# EAGLE design TriangleLEDBoard (EAGLE 9.6.1)
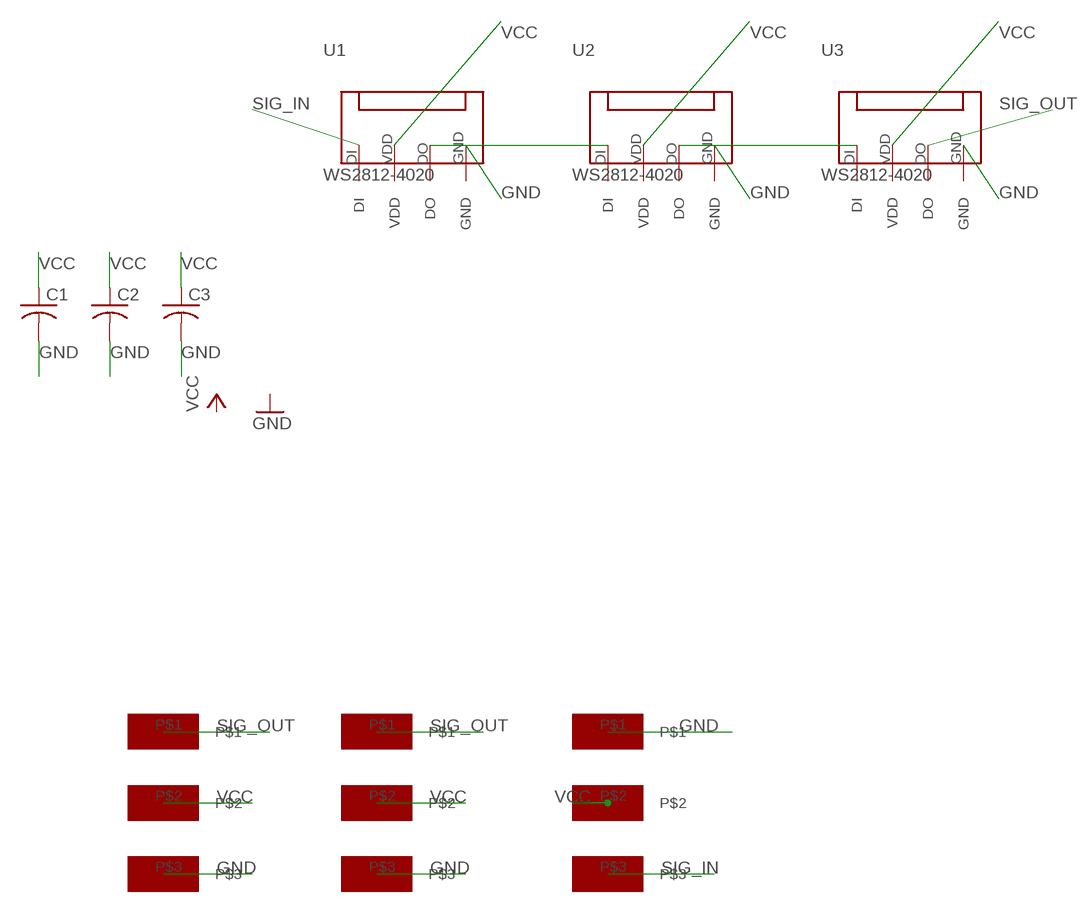
[diagram p0: schematic, sheet 1]

## Parts
C1  C-USC0603  [C0603]
C2  C-USC0603  [C0603]
C3  C-USC0603  [C0603]
U1  WS2812-4020  [WS2812B_4020]
U2  WS2812-4020  [WS2812B_4020]
U3  WS2812-4020  [WS2812B_4020]
U$1  3_CONTACT_PADS_5_MM_SPACING_WITH_HOLES  [RECTANGULAR_PADS_5_MM_SPACING_WITH_HOLES]
U$2  3_CONTACT_PADS_5_MM_SPACING_WITH_HOLES  [RECTANGULAR_PADS_5_MM_SPACING_WITH_HOLES]
U$3  3_CONTACT_PADS_5_MM_SPACING_WITH_HOLES  [RECTANGULAR_PADS_5_MM_SPACING_WITH_HOLES]

## Nets
GND: C1.2 C2.2 C3.2 U1.GND U2.GND U3.GND U$1.P$1 U$2.P$3 U$3.P$3
N$1: U1.DO U2.DI
N$2: U2.DO U3.DI
SIG_IN: U1.DI U$1.P$3
SIG_OUT: U3.DO U$2.P$1 U$3.P$1
VCC: C1.1 C2.1 C3.1 U1.VDD U2.VDD U3.VDD U$1.P$2 U$2.P$2 U$3.P$2

## Library data of the parts
C1-C3 = adafruit:C-US: CAPACITOR, American symbol
U1-U3 = debra:WS2812-4020: WS2812-4020 RGB LED
U$1-U$3 = debra:3_CONTACT_PADS_5_MM_SPACING_WITH_HOLES

## Board
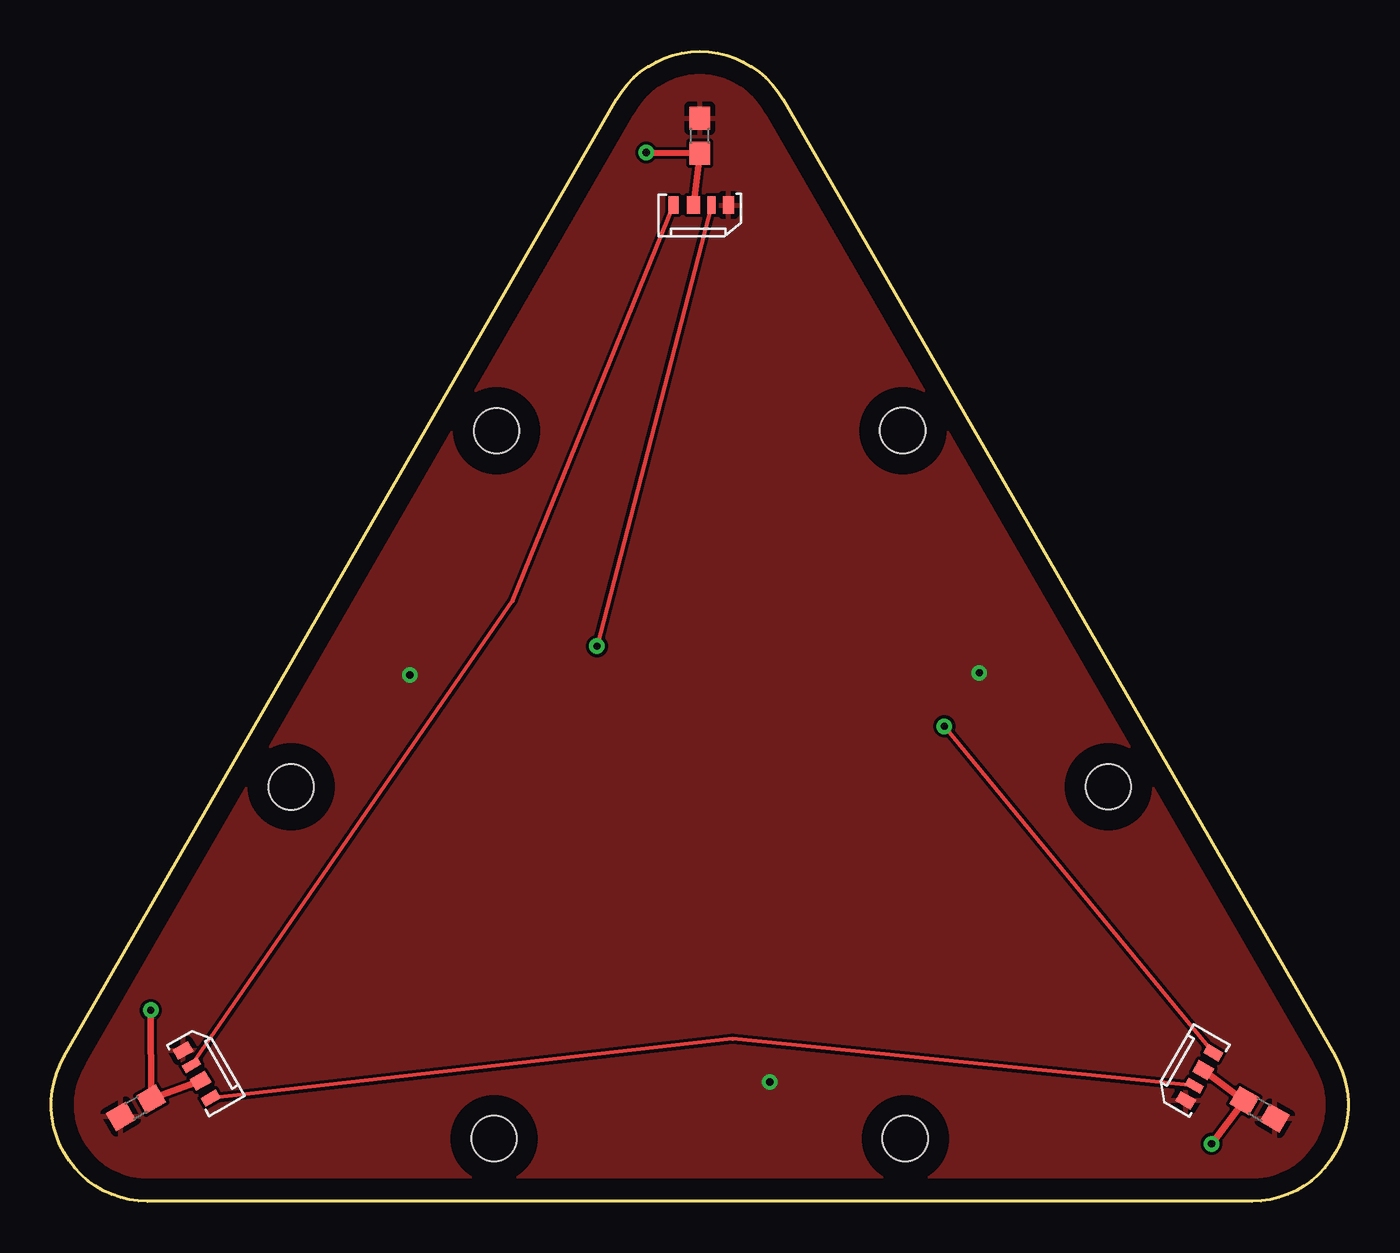
[diagram p1: board, top side]
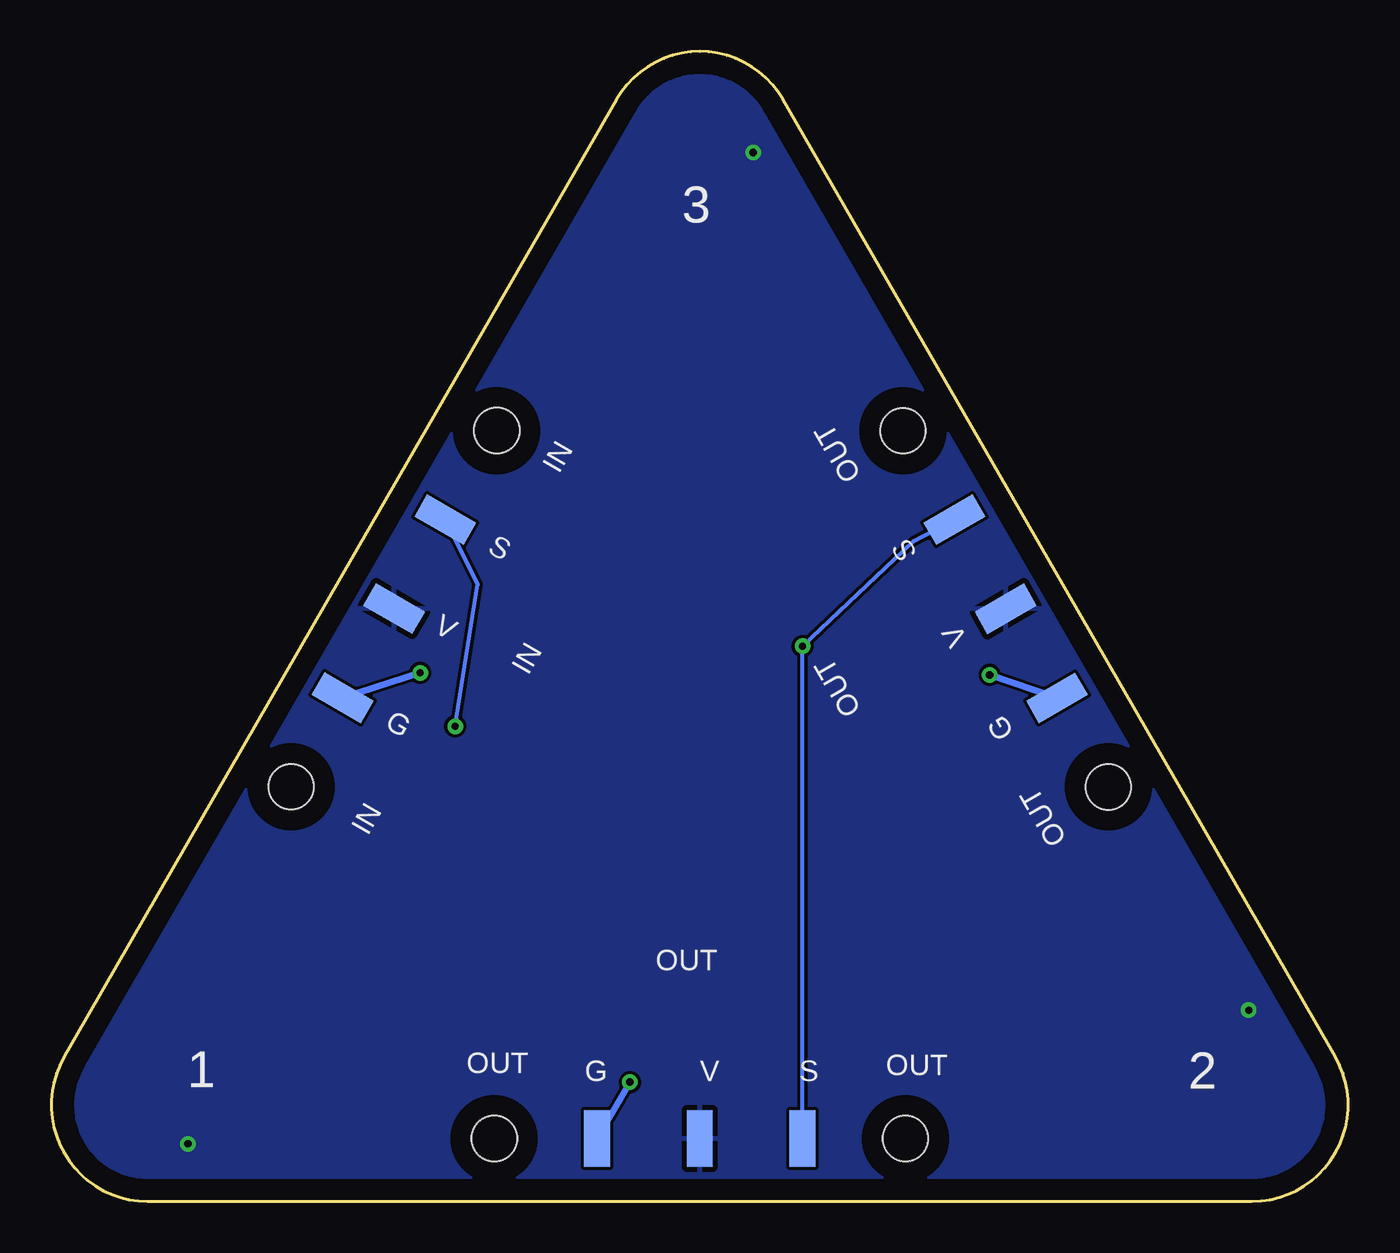
[diagram p2: board, bottom side, seen from below]

Size 63.08 x 55.92 mm. Coordinates in mm from the lower left corner, seen from the top.
Outline: 0.63,7.05 27.5,53.59 arc-120 35.58,53.59 62.45,7.05 arc-120 58.4,0 4.67,0 arc-120 0.63,7.05
Copper layers (1*16): Top 0.035mm / dielectric 1.5mm / Bottom 0.035mm
Design rules "default *": minimum track width 6mil, minimum drill 0.35mm, track to track 6mil, track to pad 6mil, pad to pad 6mil, via to via 6mil, smd to smd 6mil, copper to edge 40mil, drill to drill 6mil, minimum pad ring 10mil, minimum via ring 8mil, stop-mask expansion 4mil, vias tented up to drill 16mil, thermal gap 10mil

### Footprints (pad centres in the part's own frame; a part is rotated, then mirrored left to right if it is on the bottom)
C0603 = smd 1.1 x 1: 1 -0.85,0; 2 0.85,0
WS2812B_4020 = smd 0.5 x 0.85: DI -1.275,0.5 | smd 0.4 x 0.85: DO 0.575,0.5 | smd 0.55 x 0.85: GND 1.4,0.5 | smd 0.65 x 0.85: VDD -0.3,0.5
RECTANGULAR_PADS_5_MM_SPACING_WITH_HOLES = smd 1.25 x 2.75: P$1 -5,0; P$2 0,0; P$3 5,0 | hole 2.2: -10,0; 10,0

### Placement (x,y rotation side)
C1  58.77,4.47 330 top
C2  4.11,4.55 210 top
C3  31.55,51.82 90 top
U1  55.44,6.37 240 top
U2  7.54,6.38 120 top
U3  31.54,47.94 0 top
U$1  46.41,28.82 60 bottom
U$2  31.54,3.05 180 bottom
U$3  16.66,28.82 300 bottom

### Tracks (layer width: path | path; a pad name or v marks a point on that pad's centre or on a via)
GND  (via drill 0.35)
  Bottom 0.305: U$3.P$3 v17.44,25.6 | U$2.P$3 v34.94,5.8 | U$1.P$1 v45.14,25.7
  pour Top: -4.36,-0.08 -4.36,63.45 70.96,63.72 70.84,-0.19
N$1
  Top 0.203: U1.DO 33.14,7.9 U2.DI
N$2
  Top 0.203: U2.DO 22.44,29.2 U3.DI
SIG_IN  (via drill 0.35)
  Top 0.203: U1.DI v43.44,23.1
  Bottom 0.203: v43.44,23.1 42.34,30 U$1.P$3
SIG_OUT  (via drill 0.35)
  Top 0.203: U3.DO v26.54,27
  Bottom 0.203: U$3.P$1 21.14,32.1 v26.54,27 U$2.P$1
VCC  (via drill 0.35)
  Top 0.305: U1.VDD C1.1 v56.44,2.8 | U2.VDD C2.1 v4.84,9.3 | U3.VDD C3.1 v28.94,51
  pour Bottom: -4.19,-0.27 -4.37,61.77 68.16,62.24 69.69,-0.27

### Text on the board
bPlace: 3 | OUT | IN | S | S | V | V | IN | OUT | G | G | OUT | IN | OUT | OUT | S | V | G | OUT | 1 | 2